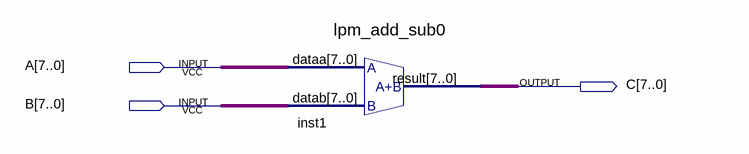
[diagram p0: schematic sheet]
// Quartus schematic ADD.bdf as structural Verilog: 1 symbols, 3 pins
module ADD (
  input  [7:0] A,
  input  [7:0] B,
  output [7:0] C
);

  lpm_add_sub0 inst1 (.dataa(A), .datab(B), .result(C));
endmodule
